# EAGLE design app_rs232_smd_v2_opto (EAGLE 5.04)

## Sheet 1 of 2
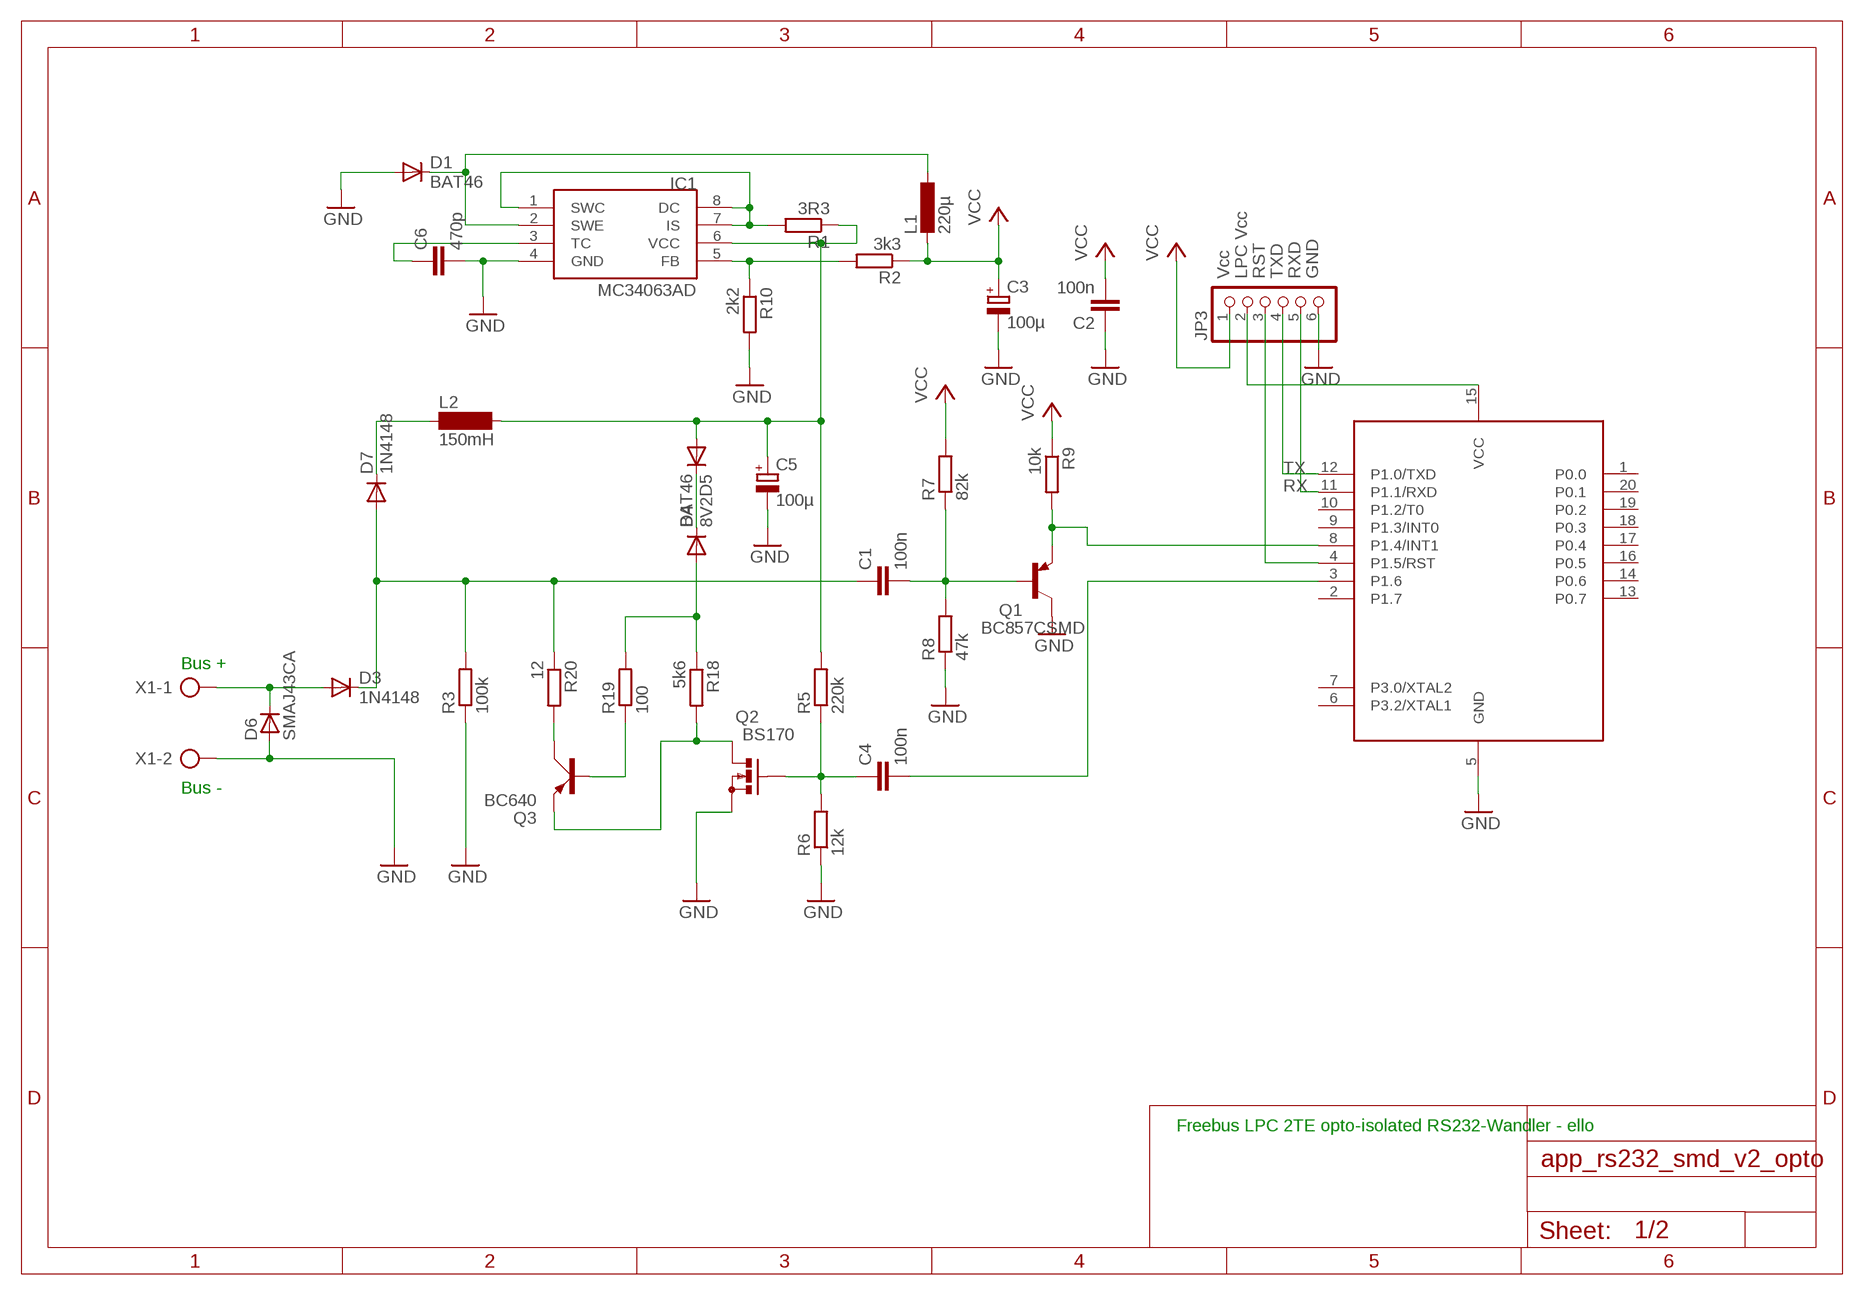
[diagram p0: schematic, sheet 1]

### Parts
C1  100n  C-EUC1206  [C1206]
C2  100n  C-EUC1206  [C1206]
C3  100µ  CPOL-EUE3.5-8  [E3,5-8]
C4  100n  C-EUC1206  [C1206]
C5  100µ  CPOL-EUE3.5-8  [E3,5-8]
C6  470p  C-EUC0805  [C0805]
D1  BAT46  DIODE-MINIMELF  [MINIMELF]
D3  1N4148  DIODE-MINIMELF  [MINIMELF]
D4  8V2  DIODE-MINIMELF  [MINIMELF]
D5  BAT46  DIODE-MINIMELF  [MINIMELF]
D6  SMAJ43CA  D-SMB  [SMB]
D7  1N4148  DIODE-MINIMELF  [MINIMELF]
IC1  MC34063AD  [SOIC8]
JP3  PINHD-1X6  [1X06]
L1  220µ  L-EUL3225M  [L3225M]
L2  150mH  SD12-1000  [SD12_1000]
Q1  BC857CSMD  [SOT23-BEC]
Q2  BS170  [SOT54E]
Q3  BC640  [SOT54D]
R1  3R3  R-EU_M0805  [M0805]
R2  3k3  R-EU_M0805  [M0805]
R3  100k  R-EU_R0805  [R0805]
R5  220k  R-EU_M0805  [M0805]
R6  12k  R-EU_M0805  [M0805]
R7  82k  R-EU_M0805  [M0805]
R8  47k  R-EU_M0805  [M0805]
R9  10k  R-EU_M0805  [M0805]
R10  2k2  R-EU_M0805  [M0805]
R18  5k6  R-EU_M0805  [M0805]
R19  100  R-EU_M0805  [M0805]
R20  12  R-EU_M0805  [M0805]
U1  89LPC922  [TSSOP20]
X1  AK500/2  [AK500/2]

### Nets
GND: C2.1 C3.- C5.- C6.2 D1.A D6.2(A) IC1.4(GND) JP3.6 Q1.C Q2.S R3.1 R6.1 R8.1 R10.2 U1.5(GND) X1.2 ; also sheet 2
N$1: Q1.E R9.2 U1.8(P1.4/INT1)
N$2: C4.2 U1.3(P1.6)
N$4: C1.1 D3.C D7.A R3.2 R20.1
N$6: Q2.D Q3.E R18.2
N$8: IC1.1(SWC) IC1.7(IS) IC1.8(DC) R1.2
N$10: C5.+ D5.A IC1.6(VCC) L2.2 R1.1 R5.2
N$11: IC1.5(FB) R2.2 R10.1
N$12: D1.C IC1.2(SWE) L1.1
N$13: D4.C D5.C
N$14: C6.1 IC1.3(TC)
N$15: D3.A D6.1(C) X1.1
N$25: D4.A R18.1 R19.2
N$26: Q3.B R19.1
N$27: D7.C L2.1
N$28: Q3.C R20.2
N$31: JP3.3 U1.4(P1.5/RST)
N$32: JP3.2 U1.15(VCC)
N$33: C4.1 Q2.G R5.1 R6.2
N$34: C1.2 Q1.B R7.1 R8.2
RX: JP3.5 U1.11(P1.1/RXD) ; also sheet 2
TX: JP3.4 U1.12(P1.0/TXD) ; also sheet 2
VCC: C2.2 C3.+ JP3.1 L1.2 R2.1 R7.2 R9.1 ; also sheet 2
Unconnected: U1.1(P0.0) U1.2(P1.7) U1.6(P3.2/XTAL1) U1.7(P3.0/XTAL2) U1.9(P1.3/INT0) U1.10(P1.2/T0) U1.13(P0.7) U1.14(P0.6) U1.16(P0.5) U1.17(P0.4) U1.18(P0.3) U1.19(P0.2) U1.20(P0.1)

### Notes on the sheet
- Vcc | LPC Vcc | RST | TXD | RXD | GND
- Bus +
- Bus -
- Freebus LPC 2TE opto-isolated RS232-Wandler - ello

## Sheet 2 of 2
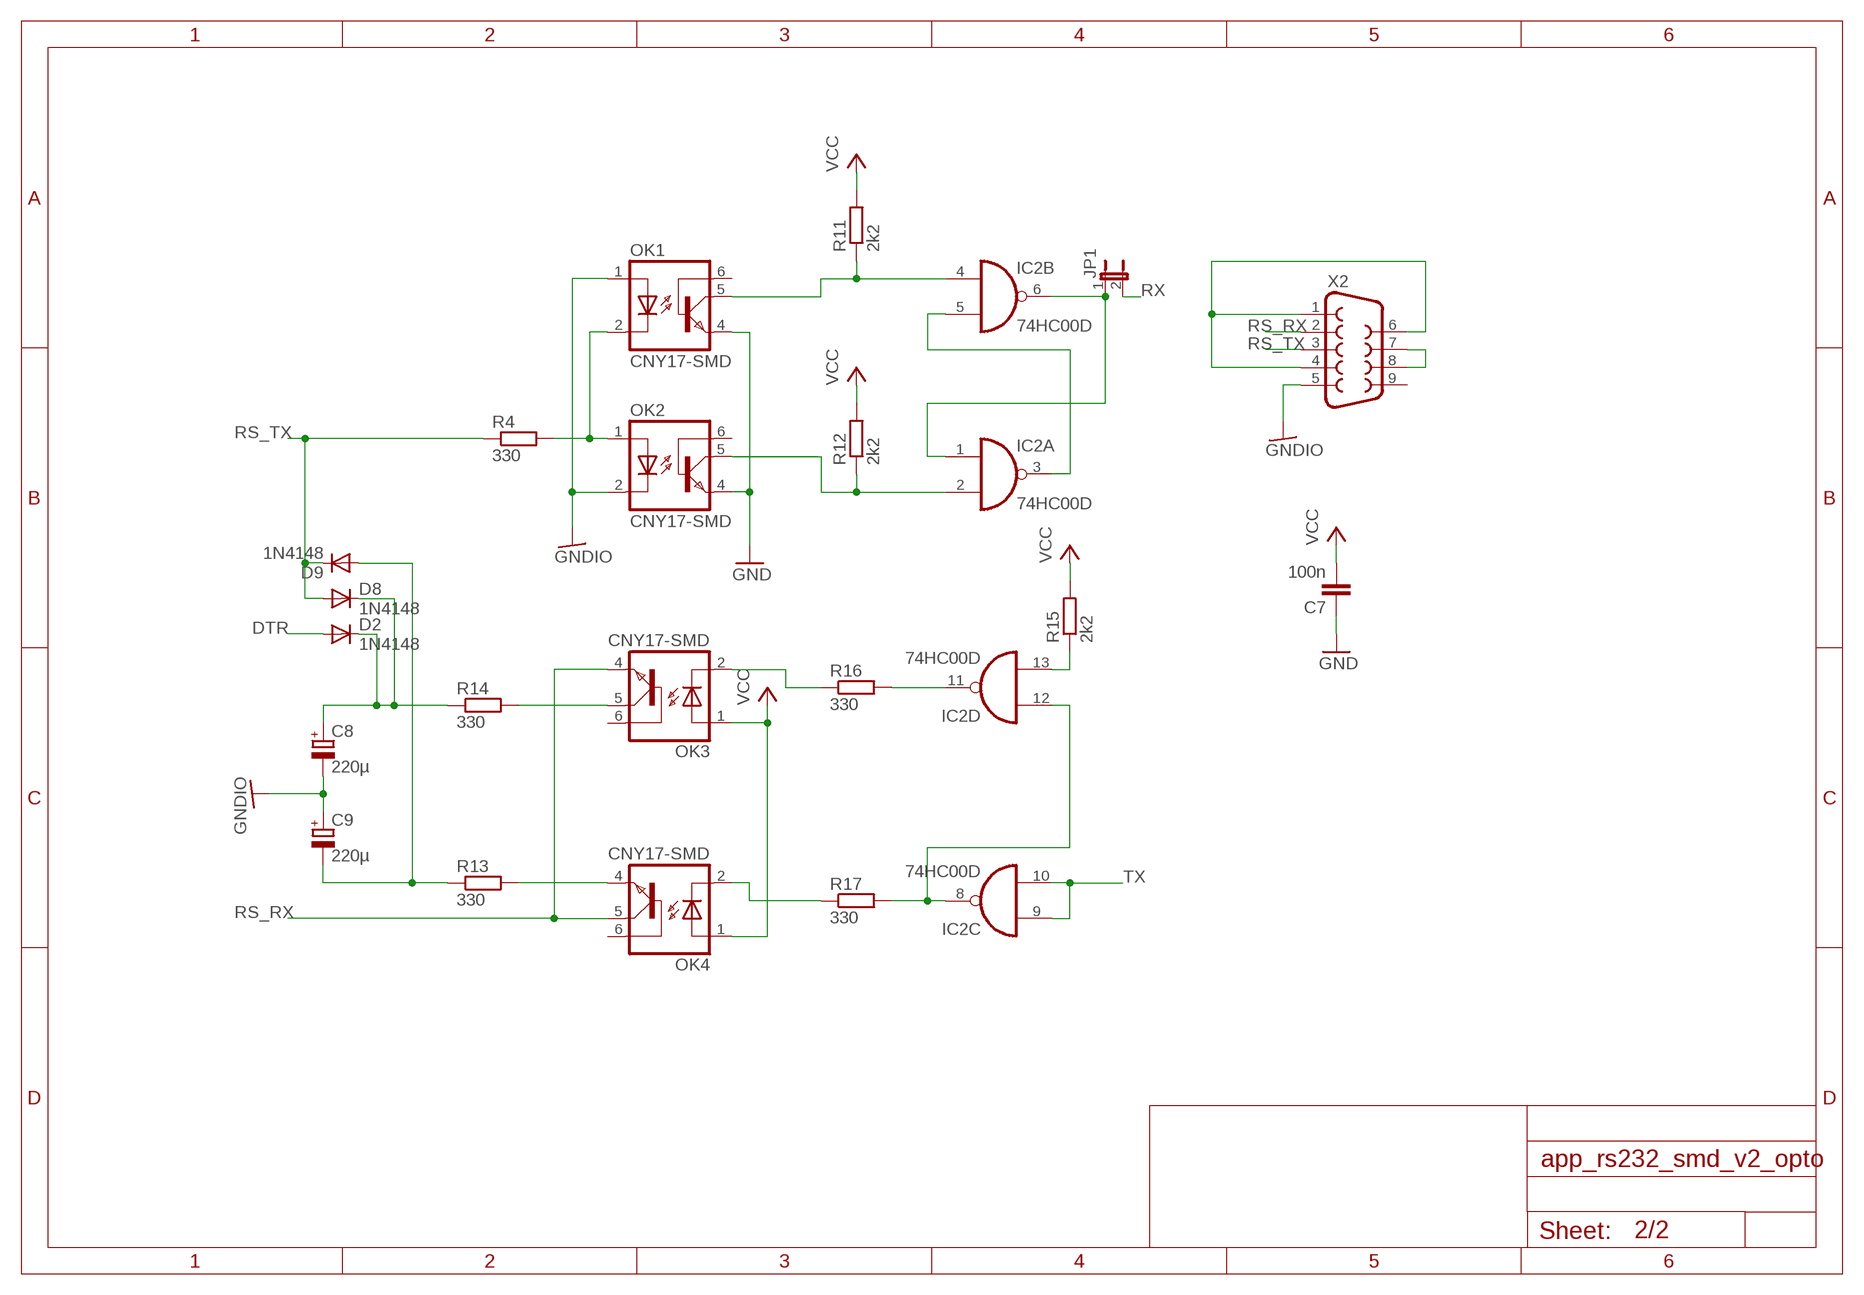
[diagram p1: schematic, sheet 2]

### Parts
C7  100n  C-EUC1206  [C1206]
C8  220µ  CPOL-EUE2.5-7  [E2,5-7]
C9  220µ  CPOL-EUE2.5-7  [E2,5-7]
D2  1N4148  DIODE-MINIMELF  [MINIMELF]
D8  1N4148  DIODE-MINIMELF  [MINIMELF]
D9  1N4148  DIODE-MINIMELF  [MINIMELF]
IC2  74HC00D  7400D  [SO14]
JP1  JP1E  [JP1]
OK1  CNY17-SMD  [DIL6-SMD]
OK2  CNY17-SMD  [DIL6-SMD]
OK3  CNY17-SMD  [DIL6-SMD]
OK4  CNY17-SMD  [DIL6-SMD]
R4  330  R-EU_M0805  [M0805]
R11  2k2  R-EU_M0805  [M0805]
R12  2k2  R-EU_M0805  [M0805]
R13  330  R-EU_M0805  [M0805]
R14  330  R-EU_M0805  [M0805]
R15  2k2  R-EU_M0805  [M0805]
R16  330  R-EU_M0805  [M0805]
R17  330  R-EU_M0805  [M0805]
X2  F09VB  [F09VB]

### Nets
DTR: D2.A X2.1 X2.4 X2.6
GND: C7.1 OK1.4(EMI) OK2.4(EMI) ; also sheet 1
GNDIO: C8.- C9.+ OK1.1(A) OK2.2(C) X2.5
N$3: IC2.8(C:O) IC2.12(D:I0) R17.2
N$5: X2.7 X2.8
N$7: OK1.2(C) OK2.1(A) R4.2
N$9: IC2.13(D:I1) R15.1
N$16: IC2.4(B:I0) OK1.5(COL) R11.1
N$17: IC2.3(A:O) IC2.5(B:I1)
N$18: OK4.2(C) R17.1
N$19: IC2.2(A:I1) OK2.5(COL) R12.1
N$20: IC2.1(A:I0) IC2.6(B:O) JP1.1
N$21: OK4.4(EMI) R13.2
N$22: C9.- D9.A R13.1
N$23: OK3.5(COL) R14.2
N$24: C8.+ D2.C D8.C R14.1
N$29: OK3.2(C) R16.1
N$30: IC2.11(D:O) R16.2
RS_RX: OK3.4(EMI) OK4.5(COL) X2.2
RS_TX: D8.A D9.C R4.1 X2.3
RX: JP1.2 ; also sheet 1
TX: IC2.9(C:I0) IC2.10(C:I1) ; also sheet 1
VCC: C7.2 OK3.1(A) OK4.1(A) R11.2 R12.2 R15.2 ; also sheet 1
Unconnected: OK1.6(BAS) OK2.6(BAS) OK3.6(BAS) OK4.6(BAS) X2.9

## Power pins joined to a net without a drawn wire
GND: IC2.7(P:GND)
VCC: IC2.14(P:VCC)

## Library data of the parts
C1 C2 C4 C6 C7 = rcl:C-EU: CAPACITOR, European symbol
C3 C5 C8 C9 = rcl:CPOL-EU: POLARIZED CAPACITOR, European symbol
D1-D5 D7-D9 = diode:DIODE-: DIODE
D6 = semicon-smd-ipc:D-: DIODE unfilled
IC1 = mc34063:MC34063
IC2 = 74xx-eu:74*00: Quad 2-input NAND gate
JP1 = jumper:JP1E: JUMPER
JP3 = pinhead:PINHD-1X6: PIN HEADER
L1 = rcl:L-EU: INDUCTOR, European symbol
L2 = inductor-neosid:SD12: INDUCTOR nominal inductance
OK1-OK4 = optocoupler:CNY17: SIEMENS OPTO COUPLER
Q1 = transistor-pnp:BC857*: PNP Transistror
Q2 = transistor-small-signal:BS170: N-CHANNEL MOS FET
Q3 = transistor-small-signal:BC640: PNP TRANSISTOR
R1-R20 = rcl:R-EU_: RESISTOR, European symbol
U1 = lpc:89LPC922
X1 = con-ptr500:AK500/2: CONNECTOR
X2 = con-subd:F09: SUB-D

## Board
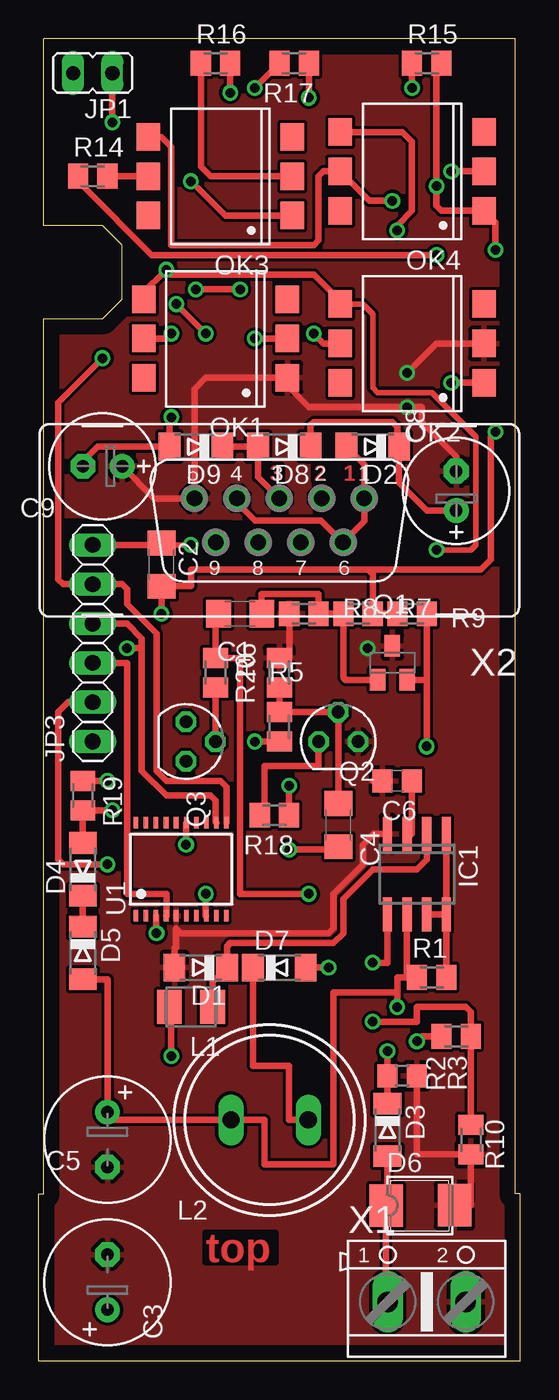
[diagram p2: board, top side]
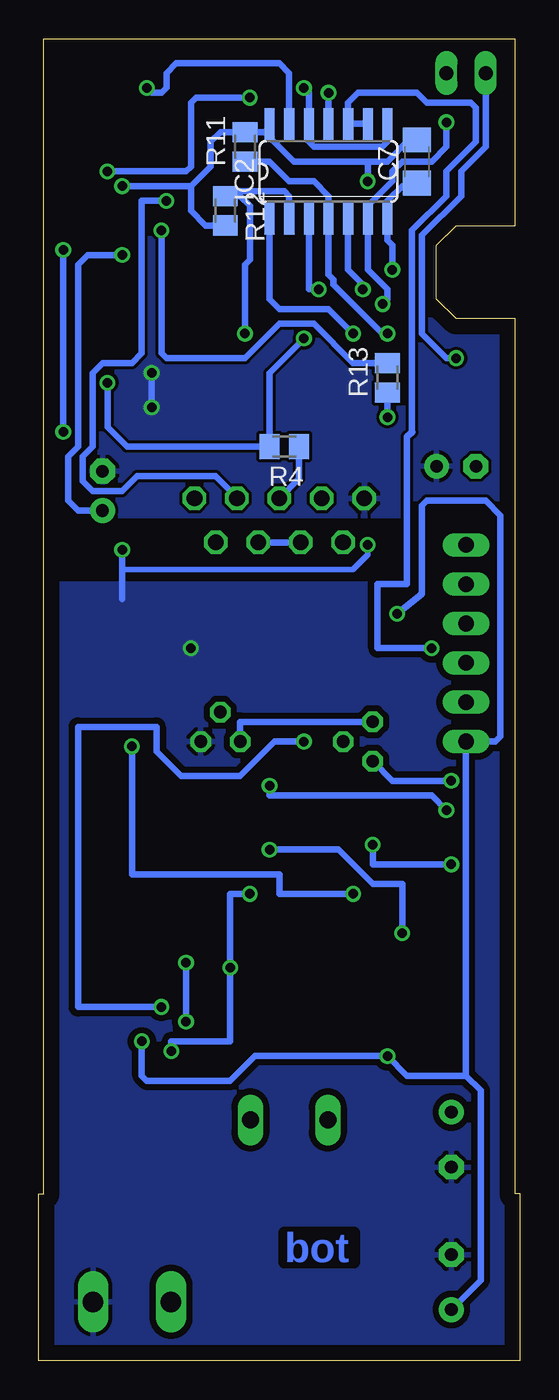
[diagram p3: board, bottom side, seen from below]

Size 31.11 x 85.41 mm. Coordinates in mm from the lower left corner, seen from the top.
Outline: 0,0 0,10.79 0.32,10.79 0.32,67.31 4.13,67.31 5.4,68.58 5.4,72.07 4.13,73.34 0.32,73.34 0.32,85.41 30.8,85.41 30.8,10.79 31.11,10.79 31.11,0 0,0
Copper layers (1*16): Top 0.035mm / dielectric 1.5mm / Bottom 0.035mm
Design rules "tu-lpl": minimum track width 14mil, minimum drill 24mil, track to track 8mil, track to pad 8mil, pad to pad 8mil, via to via 8mil, smd to smd 8mil, copper to edge 40mil, drill to drill 8mil, minimum pad ring 10mil, minimum via ring 8mil, stop-mask expansion 4mil, vias tented up to drill 0mil, thermal gap 10mil

### Footprints (pad centres in the part's own frame; a part is rotated, then mirrored left to right if it is on the bottom)
C1206 = smd 1.6 x 1.8: 1 -1.4,0; 2 1.4,0
E3,5-8 = drill 0.813 pad 1.6 round: + -1.778,0 | drill 0.813 pad 1.6 octagon: - 1.778,0
C0805 = smd 1.3 x 1.5: 1 -0.95,0; 2 0.95,0
E2,5-7 = drill 0.813 pad 1.6 round: + -1.27,0 | drill 0.813 pad 1.6 octagon: - 1.27,0
MINIMELF = smd 1.4 x 1.8: A 1.7,0; C -1.7,0
SMB = smd 2.159 x 2.743: 1 -2.311,-0.127; 2 2.108,-0.102
SOIC8 = smd 0.6 x 2.2: 1 -1.905,-2.6; 2 -0.635,-2.6; 3 0.635,-2.6; 4 1.905,-2.6; 5 1.905,2.6; 6 0.635,2.6; 7 -0.635,2.6; 8 -1.905,2.6
SO14 = smd 0.66 x 2.032: 1 -3.81,-3.073; 2 -2.54,-3.073; 3 -1.27,-3.073; 4 0,-3.073; 5 1.27,-3.073; 6 2.54,-3.073; 7 3.81,-3.073; 8 3.81,3.073; 9 2.54,3.073; 10 1.27,3.073; 11 0,3.073; 12 -1.27,3.073; 13 -2.54,3.073; 14 -3.81,3.073
JP1 = drill 0.914 long: 1 0,-1.27; 2 0,1.27
1X06 = drill 1.016 long: 1 -6.35,0; 2 -3.81,0; 3 -1.27,0; 4 1.27,0; 5 3.81,0; 6 6.35,0
L3225M = smd 1.6 x 2.2: 1 -1.4,0; 2 1.4,0
SD12_1000 = drill 1.1 long: 1 -2.5,0; 2 2.5,0
DIL6-SMD = smd 1.78 x 1.52: 1 -2.54,-4.645; 2 0,-4.645; 3 2.54,-4.645; 4 2.54,4.645; 5 0,4.645; 6 -2.54,4.645
SOT23-BEC = smd 1 x 1.4: B -0.95,-1.1; C 0,1.1; E 0.95,-1.1
SOT54E = drill 0.813 octagon: D -1.27,0; G 0,1.905; S 1.27,0
SOT54D = drill 0.813 octagon: B 1.27,0; C 0,1.905; E -1.27,0
M0805 = smd 1.3 x 1.6: 1 -0.95,0; 2 0.95,0
R0805 = smd 1.3 x 1.5: 1 -0.95,0; 2 0.95,0
TSSOP20 = smd 0.3 x 0.75: 1 -2.925,-3; 2 -2.275,-3; 3 -1.625,-3; 4 -0.975,-3; 5 -0.325,-3; 6 0.325,-3; 7 0.975,-3; 8 1.625,-3; 9 2.275,-3; 10 2.925,-3; 11 2.925,3; 12 2.275,3; 13 1.625,3; 14 0.975,3; 15 0.325,3; 16 -0.325,3; 17 -0.975,3; 18 -1.625,3; 19 -2.275,3; 20 -2.925,3
AK500/2 = drill 1.321 long: 1 -2.515,0; 2 2.515,0
F09VB = drill 1.016 octagon: 1 -5.486,-1.422; 2 -2.743,-1.422; 3 0,-1.422; 4 2.743,-1.422; 5 5.486,-1.422; 6 -4.115,1.422; 7 -1.372,1.422; 8 1.372,1.422; 9 4.115,1.422

### Placement (x,y rotation side)
C1  13.02,48.26 0 top
C2  7.94,51.44 270 top
C3  4.45,5.08 90 top
C4  19.37,34.61 270 top
C5  4.45,14.29 270 top
C6  23.18,37.47 180 top
C7  6.67,77.47 90 bottom
C8  26.99,56.2 90 top
C9  4.13,57.78 180 top
D1  10.48,25.4 180 top
D2  21.59,59.05 180 top
D3  22.54,14.92 270 top
D4  2.86,31.75 90 top
D5  2.86,26.35 270 top
D6  24.77,10.16 0 top
D7  15.56,25.4 0 top
D8  15.88,59.05 180 top
D9  10.16,59.05 180 top
IC1  24.45,31.43 180 top
IC2  12.38,76.83 0 bottom
JP1  3.49,83.19 90 top
JP3  3.49,46.35 90 top
L1  9.84,22.86 180 top
L2  14.92,15.56 180 top
OK1  11.43,66.04 90 top
OK2  24.13,65.72 90 top
OK3  11.75,76.52 90 top
OK4  24.13,76.83 90 top
Q1  22.86,45.09 0 top
Q2  19.37,40.01 0 top
Q3  9.53,40.01 270 top
R1  25.4,24.77 0 top
R2  26.99,20.95 0 top
R3  23.5,18.41 180 top
R4  15.24,59.05 180 bottom
R5  15.56,40.96 270 top
R6  15.56,44.45 270 top
R7  20.64,48.26 0 top
R8  17.14,48.26 0 top
R9  24.13,48.26 0 top
R10  27.94,14.29 270 top
R11  17.78,78.42 90 bottom
R12  19.05,74.3 270 bottom
R13  8.57,63.5 90 bottom
R14  3.49,76.52 0 top
R15  25.08,83.82 0 top
R16  11.43,83.82 0 top
R17  16.51,83.82 180 top
R18  15.24,35.24 180 top
R19  2.86,36.51 270 top
R20  11.43,44.45 270 top
U1  9.21,31.75 0 top
X1  25.08,3.81 0 top
X2  15.56,54.29 180 top

### Tracks (layer width: path | path; a pad name or v marks a point on that pad's centre or on a via)
DTR
  Top 0.406: X2.4 12.81,55.45 13.97,54.29 18.25,54.29 X2.6 21.04,54.24 X2.1 21.04,57.9 D2.A
GND  (via drill 0.61)
  Top 0.356: 7.94,52.7 v9.84,52.7 | v25.72,52.39 27.94,52.39 28.26,52.7 28.26,59.69 25.4,62.55 21.91,62.55 21.59,62.87 21.59,67.63 20.95,68.26 OK2.4
  Top 0.406: X1.2 26.87,3.81 | D6.2 27.94,10.06 R10.2 24.45,13.34 R3.1 | 8.78,26.04 D1.A 8.78,26.67 8.89,26.67 8.89,27.94 9.21,27.62 18.73,27.62 19.05,27.94 19.05,30.16 20.95,32.07 20.95,33.34 21.65,34.03 IC1.4 | C6.2 21.59,37.47 | 15.24,45.4 R6.1 16.2,45.4 R8.1 | C2.1 7.94,52.7 JP3.6 | OK1.4 6.67,68.7 6.67,68.9 v8.26,70.48 8.57,70.17 17.78,70.17 19.37,68.58 19.68,68.58 19.48,68.38 OK2.4
  Bottom 0.356: 25.72,51.12 10.79,51.12 9.84,52.07 v9.84,52.7
  Bottom 0.406: C7.1 6.86,75.88 7.62,75.88 8.57,74.93 IC2.7 8.57,72.39 8.26,72.07 v8.26,70.48 | v25.72,52.39 25.72,51.12 25.72,49.21
  other vias: 21.27,46.04
  pour Top: 0.32,51.12 30.8,51.12 30.48,0 0,0
  pour Bottom (isolate 0.406): 0.32,50.16 30.8,50.16 30.48,0 0,0
GNDIO  (via drill 0.61)
  Top 0.406: C9.+ 7.47,55.72 X2.5 10.07,62.78 10.79,63.5 OK1.1 16.07,62.98 17.46,61.59 v23.81,61.59 24.77,61.59 24.77,60.64 26.99,58.42 C8.- | OK2.2 25.72,65.72 v23.81,63.82
  Bottom 0.406: v23.81,61.59 v23.81,63.82
  pour Bottom: 0.32,54.61 30.8,54.61 30.8,85.41 0.32,85.41
  pour Top: 0.32,54.61 30.8,54.29 30.8,85.72 0.32,85.72
N$1  (via drill 0.61)
  Top 0.406: U1.8 10.79,28.75 v10.79,30.16 | v25.08,39.69 25.08,44.13 | 25.08,44.13 25.08,44.45 | 25.08,44.45 25.08,46.04 R9.2 | 25.08,44.45 | Q1.E 24.93,43.98 25.08,44.13
  Bottom 0.406: v10.79,30.16 15.56,30.16 15.56,31.43 25.08,31.43 v25.08,39.69
N$2  (via drill 0.61)
  Top 0.406: U1.3 7.58,27.66 v7.62,27.62 | v16.19,33.02 18.92,33.02 C4.2
  Bottom 0.406: v7.62,27.62 7.62,30.8 9.53,30.8 11.75,33.02 v16.19,33.02
N$3  (via drill 0.61)
  Top 0.406: v13.97,82.23 R17.2
  Bottom 0.406: v13.97,82.23 13.65,81.92 IC2.12 13.65,78.74 13.34,78.42 8.89,78.42 8.57,78.74 IC2.8
N$4  (via drill 0.61)
  Top 0.406: D3.C R3.2 22.55,19.68 v22.54,20 | C1.1 11.43,48.26 R20.1 13.02,45.4 13.02,30.16 v17.46,30.16 | v18.73,25.4 D7.A
  Bottom 0.406: v17.46,30.16 18.73,30.16 v18.73,25.4 18.73,20.64 22.54,20.64 v22.54,20
N$5
  Bottom 0.406: X2.8 X2.7
N$6
  Top 0.406: R18.2 14.61,35.88 14.61,38.42 18.1,38.42 Q2.D
  Bottom 0.406: Q3.E 18.1,41.27 Q2.D
N$7  (via drill 0.61)
  Top 0.406: v13.97,66.04 OK1.2 | v26.67,63.18 OK2.1
  Bottom 0.406: v13.97,66.04 16.19,63.82 R4.2 25.4,59.05 26.67,60.33 v26.67,63.18
N$8
  Top 0.406: R1.2 IC1.8 | IC1.8 IC1.7 | IC1.8 IC1.1
N$9  (via drill 0.61)
  Top 0.406: v24.13,82.23 R15.1
  Bottom 0.406: IC2.13 14.92,83.19 15.56,83.82 22.23,83.82 22.86,83.19 22.86,82.23 23.18,81.92 23.81,81.92 v24.13,82.23
N$10  (via drill 0.61)
  Top 0.406: D5.A 4.45,24.65 C5.+ 4.45,15.56 L2.2 14.61,15.56 14.61,12.7 19.05,12.7 19.05,23.81 23.18,23.81 | 23.81,24.77 R1.1 | 23.81,24.77 IC1.6 | 23.18,23.81 23.18,24.77 23.81,24.77 | R5.2 v13.97,40.01 | 23.18,23.81 v23.18,22.86
  Bottom 0.406: v13.97,40.01 15.88,40.01 18.1,37.78 21.91,37.78 23.5,39.37 23.5,40.96 28.57,40.96 28.57,22.86 v23.18,22.86
N$11  (via drill 0.61)
  Top 0.406: R10.1 R2.2 27.94,22.55 27.62,22.86 24.45,22.86 24.45,21.91 v21.59,21.91 | v21.59,25.72 22.54,25.72 IC1.5
  Bottom 0.406: v21.59,21.91 v21.59,25.72
N$12
  Top 0.406: L1.1 11.24,24.46 D1.C 12.18,26.78 12.38,26.99 19.05,26.99 19.68,27.62 19.68,29.84 21.59,31.75 24.45,31.75 25.08,32.38 IC1.2
N$13
  Top 0.406: D5.C D4.C
N$14
  Top 0.406: IC1.3 24.13,34.03 C6.1
N$15
  Top 0.406: X1.1 22.45,3.81 D6.1 22.54,10.03 D3.A
N$16  (via drill 0.61)
  Top 0.406: OK1.5 8.26,66.04 v8.57,66.36
  Bottom 0.406: R11.1 16.19,77.47 14.92,76.2 13.34,76.2 12.38,75.25 IC2.4 12.38,70.17 12.06,69.85 12.06,69.53 8.89,66.36 v8.57,66.36
N$17  (via drill 0.61)
  Top 0.406: v10.16,69.22 v13.02,69.22
  Bottom 0.406: IC2.3 13.65,69.22 v13.02,69.22 | IC2.5 11.11,70.48 10.16,69.53 v10.16,69.22
N$18  (via drill 0.61)
  Top 0.406: v26.67,76.83 OK4.2 | v17.46,81.6 R17.1
  Bottom 0.406: v26.67,76.83 21.59,76.83 21.27,77.15 21.27,81.28 20.95,81.6 v17.46,81.6
N$19  (via drill 0.61)
  Top 0.406: OK2.5 18.41,65.72 v17.78,66.36
  Bottom 0.406: v17.78,66.36 17.78,70.8 17.46,71.12 17.46,74.61 18.09,75.25 18.41,75.25 | 18.41,75.25 R12.1 | IC2.2 14.92,75.25 15.24,75.56 18.09,75.56 18.41,75.25
N$20  (via drill 0.61)
  Top 0.406: v8.89,68.26 v10.79,66.36 | JP1.1 v4.76,80.01
  Bottom 0.406: v8.89,68.26 8.57,68.58 8.57,69.22 9.84,70.48 IC2.6 9.84,74.61 8.26,76.2 8.26,76.83 7.62,77.47 5.71,77.47 4.76,78.42 v4.76,80.01 | v10.79,66.36 12.38,67.94 15.56,67.94 16.19,68.58 IC2.1
N$21  (via drill 0.61)
  Top 0.406: v23.18,73.03 23.18,73.34 24.13,74.3 24.13,78.74 23.5,79.38 OK4.4
  Bottom 0.406: R13.2 10.79,64.45 13.34,66.99 15.56,66.99 17.78,64.77 22.86,64.77 23.18,65.09 v23.18,73.03
N$22  (via drill 0.61)
  Top 0.406: C9.- 2.86,58.1 3.81,59.05 D9.A 8.46,60.53 v8.57,60.96
  Bottom 0.406: v8.57,60.96 R13.1
N$23
  Top 0.406: R14.2 OK3.5
N$24  (via drill 0.61)
  Top 0.406: C8.+ 25.08,54.93 23.29,56.72 D2.C 23.18,59.17 23.18,60.33 22.86,60.64 17.78,60.64 17.57,60.44 D8.C | R14.1 2.86,75.88 7.3,71.44 v25.72,71.44
  Bottom 0.406: v25.72,71.44 27.94,71.44 28.57,70.8 28.57,59.05 29.21,58.42 29.21,55.56 28.57,54.93 C8.+
N$25  (via drill 0.61)
  Top 0.406: D4.A R19.2 3.5,35.56 v4.76,35.56 | v16.19,37.15 R18.1
  Bottom 0.406: v16.19,37.15 16.19,36.51 5.71,36.51 v4.76,35.56
N$26  (via drill 0.61)
  Top 0.406: 3.49,37.47 R19.1 v4.44,37.46 v4.45,37.47
  Bottom 0.406: v4.45,37.47 8.26,37.47 Q3.B
N$27
  Top 0.406: L2.1 16.19,15.56 16.19,19.05 13.86,19.05 D7.C
N$28
  Top 0.406: Q3.C R20.2
N$29
  Top 0.406: R16.1 10.48,77.15 11.11,76.52 OK3.2
N$30  (via drill 0.61)
  Top 0.406: v12.38,81.92 12.38,83.5 R16.2
  Bottom 0.406: IC2.11 v12.38,81.92
N$31
  Top 0.406: U1.4 8.26,28.75 8.26,30.16 5.71,30.16 5.71,45.09 JP3.3
N$32  (via drill 0.61)
  Top 0.406: JP3.2 1.91,42.55 1.27,41.91 1.27,32.38 1.59,32.07 v4.45,32.07 | U1.15 v9.53,33.34
  Bottom 0.406: v9.53,33.34 9.53,32.07 v4.45,32.07
N$33
  Top 0.406: R6.2 R5.1 19.05,41.91 Q2.G C4.1
N$34
  Top 0.406: C1.2 14.42,49.53 18.1,49.53 R8.2 R7.1 19.68,44.13 19.83,43.98 Q1.B
RS_RX  (via drill 0.61)
  Top 0.406: v22.86,74.93 21.39,74.93 OK4.5 18.41,76.83 18.1,76.52 18.1,72.39 17.78,72.07 8.57,72.07 8.57,78.42 7.94,79.06 OK3.4
  Bottom 0.406: X2.2 18.3,55.77 19.68,57.15 24.77,57.15 25.72,56.2 27.62,56.2 28.26,56.83 28.26,58.42 27.62,59.05 27.62,63.82 26.99,64.45 25.08,64.45 24.45,65.09 24.45,74.93 v22.86,74.93
RS_TX
  Top 0.406: X2.3 14.18,57.1 D8.A D9.C
  Bottom 0.406: R4.1 14.29,56.98 X2.3
RX  (via drill 0.61)  (1 unrouted)
  Top 0.406: U1.11 12.13,37.08 11.75,37.47 8.26,37.47 7.62,38.1 7.62,46.99 5.71,48.9 5.71,49.85 5.4,50.16 JP3.5 1.59,50.16 1.27,50.48 1.27,61.91 v4.13,64.77
  Bottom 0.406: v4.13,64.77 4.76,64.77 6.35,66.36 6.35,72.71 3.81,75.25 3.81,76.83 2.22,78.42 JP1.2
TX  (via drill 0.61)
  Top 0.406: JP3.4 5.71,47.62 6.67,46.67 6.67,46.04 | 6.67,46.04 6.67,38.1 8.26,36.51 11.11,36.51 11.43,36.2 11.43,34.8 U1.12 | 6.67,46.04 v5.71,46.04
  Bottom 0.406: v5.71,46.04 9.21,46.04 9.21,50.16 7.3,50.16 7.3,59.69 6.97,59.99 6.99,60.01 6.99,73.03 4.76,75.25 4.76,76.83 2.86,78.74 2.86,80.96 3.17,81.28 6.03,81.28 6.67,81.92 10.48,81.92 11.11,81.28 IC2.10 IC2.9
VCC  (via drill 0.61)
  Top 0.406: C2.2 7.3,50.03 | R9.1 R7.2 21.59,50.8 21.27,51.12 | C2.2 9.84,50.03 9.84,51.12 21.27,51.12 | 21.27,51.12 21.59,51.12 | 21.59,51.12 | v7.94,48.26 C2.2 | R15.2 25.72,83.5 v25.72,75.88 25.72,74.61 26.04,74.3 OK4.1 29.53,73.54 v29.53,71.75 | OK3.1 12.06,73.98 v9.84,76.2 | 21.59,51.12 28.57,51.12 29.21,51.75 29.21,59.69 v29.53,60.01 | v8.57,19.68 8.57,22.73 L1.2 | R2.1 24.77,20.95 v24.45,20.64
  Bottom 0.406: v7.94,48.26 6.35,49.53 6.35,55.24 6.03,55.56 2.22,55.56 1.27,54.61 1.27,40.32 1.59,40.01 JP3.1 3.49,18.41 | IC2.14 16.19,79.69 16.51,79.37 | 16.51,79.37 R11.2 19.37,79.37 20,78.74 20,77.15 21.27,75.88 | v25.72,75.88 21.27,75.88 | C7.2 7.17,78.87 8.57,77.47 9.84,77.47 | 9.84,77.47 14.61,77.47 16.51,79.37 | 9.84,77.47 v9.84,76.2 | v29.53,60.01 v29.53,71.75 | R12.2 20.32,73.34 21.27,74.3 21.27,75.88 | 3.49,18.41 2.54,17.46 2.54,5.21 C3.+ | 3.49,18.41 7.3,18.41 v8.57,19.68 17.14,19.68 18.73,18.1 24.13,18.1 24.45,18.41 v24.45,20.64

### Text on the board
Top: 3 | 2 | 1 | top
Bottom: bot